# Altium project Luna_UI_V2.0.PrjPcb
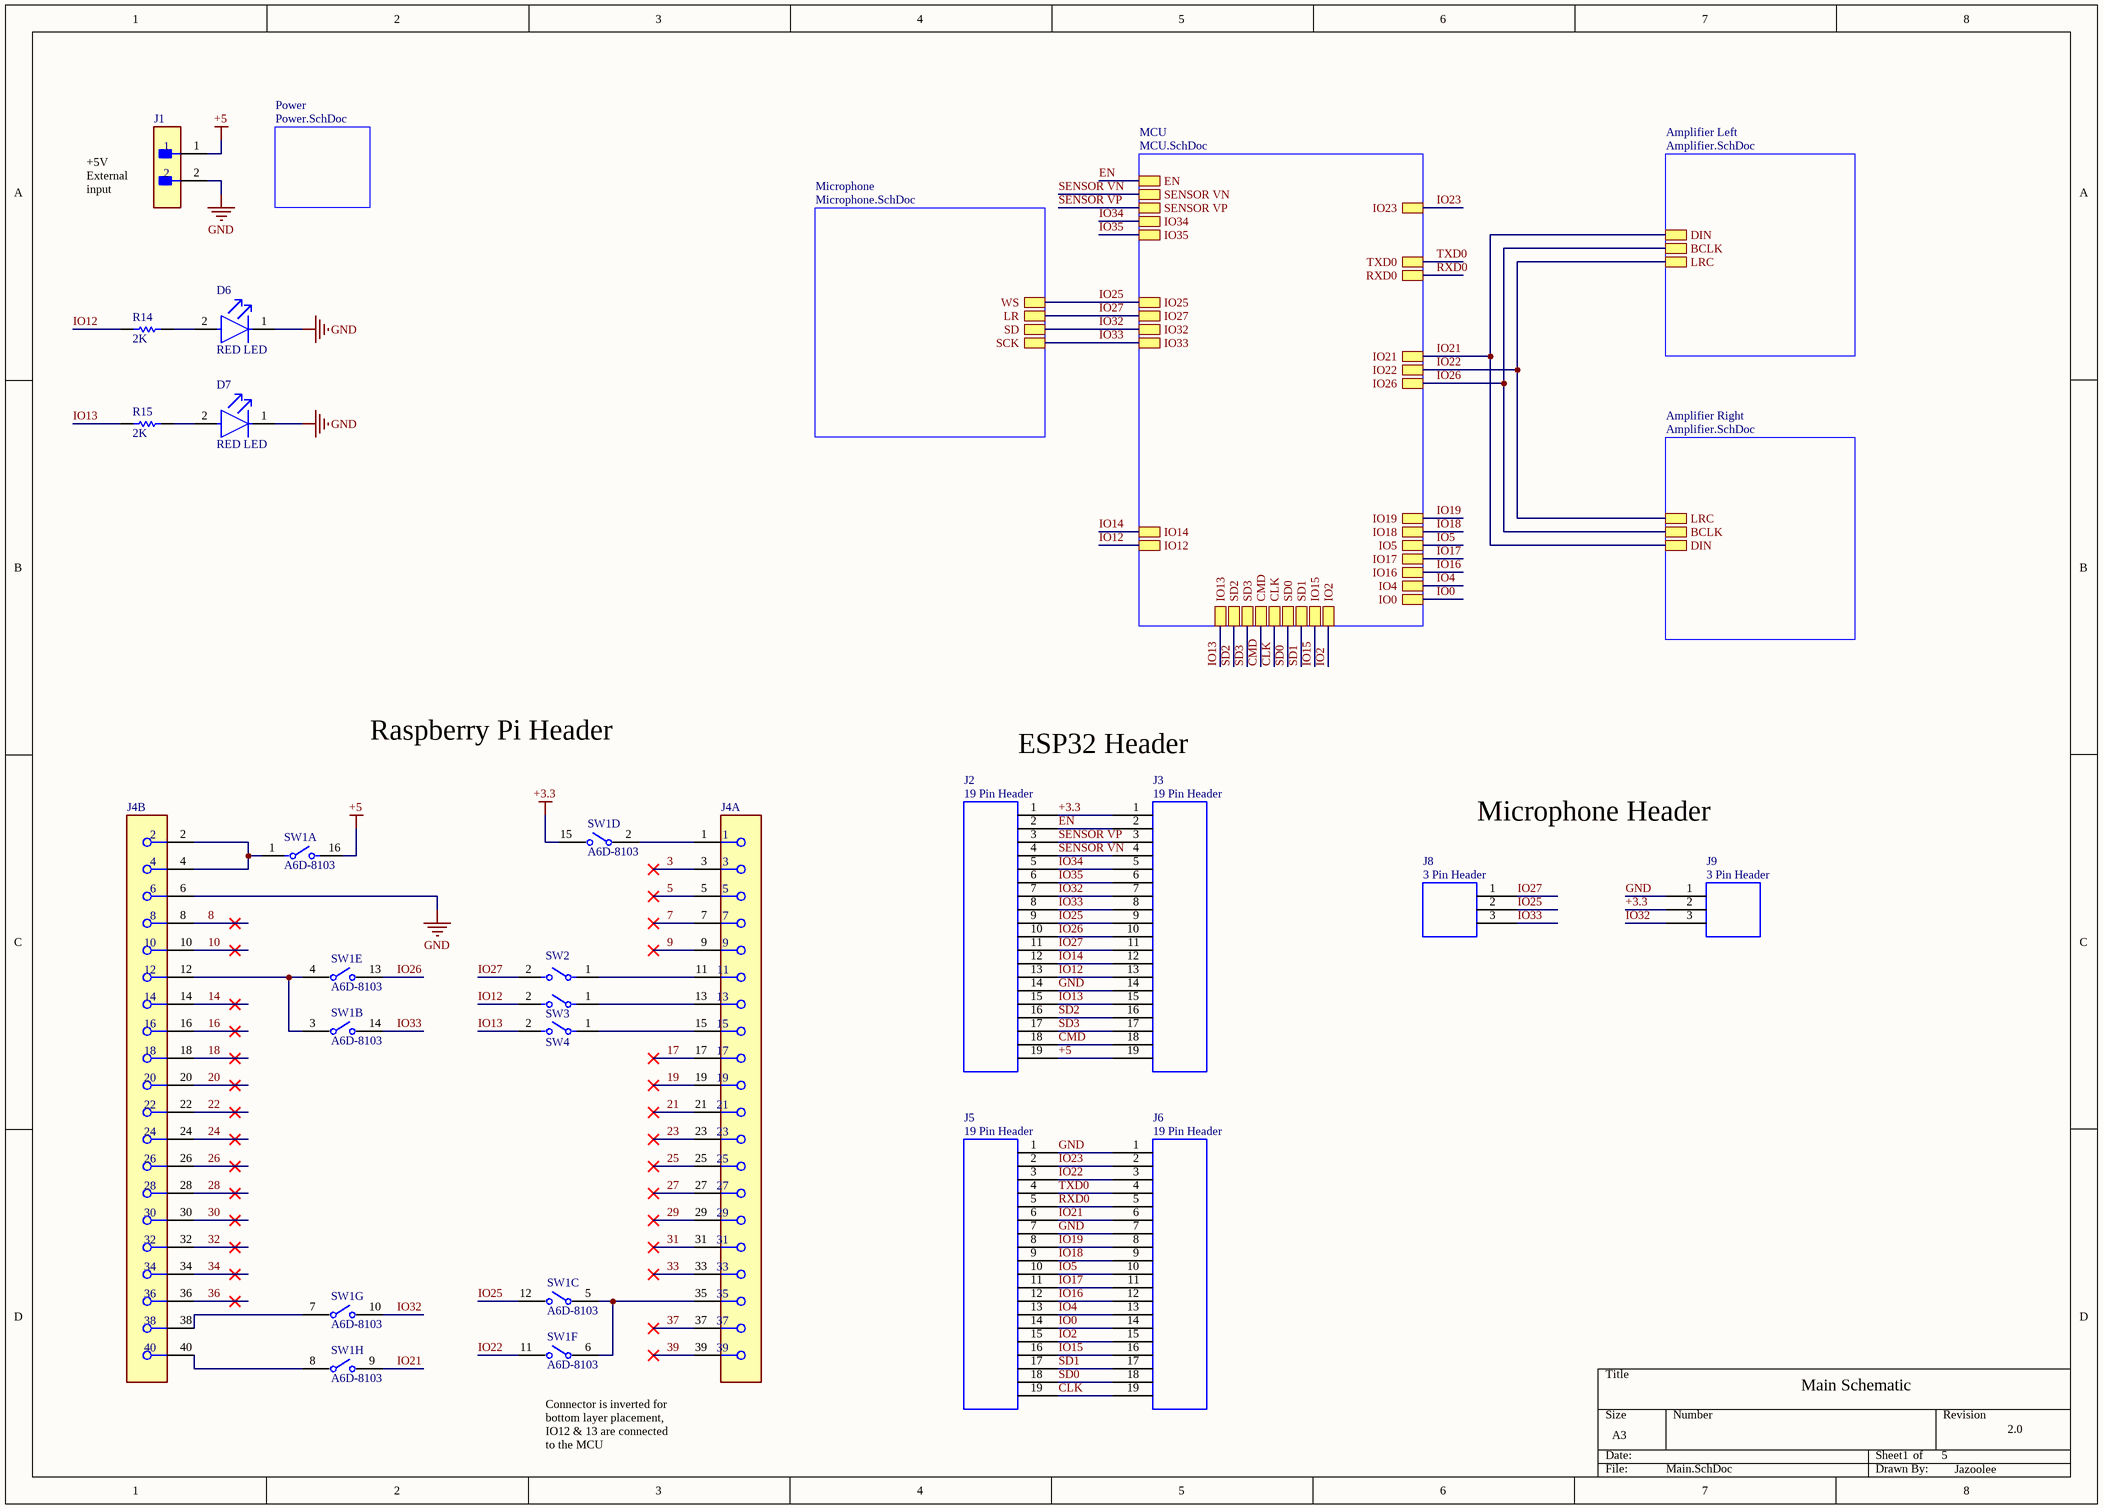
[diagram p0: Main.SchDoc]
5 sheets, 61 parts. Net scope: hierarchical (ports join the sheet entries above them; power ports are global).
Board file: Main.PcbDoc
Sheets:
  Main.SchDoc
    MCU = MCU.SchDoc
    Microphone = Microphone.SchDoc
    Amplifier Left = Amplifier.SchDoc
    Amplifier Right = Amplifier.SchDoc
    Power = Power.SchDoc

## Sheet Main.SchDoc
size A3; SheetNumber: 1; SheetTotal: 5

### Parts
D6  Color: RED LED  [FP-HSMS-C150-MFG]  (hidden comment: HSMS-C150)
D7  Color: RED LED  [FP-HSMS-C150-MFG]  (hidden comment: HSMS-C150)
J1  B2B-XH-A(LF)(SN)  [FP-B2B-XH-A_LF_SN-MFG]  (value not drawn)
J2  19 Pin Header  [19 Pin Header]
J3  19 Pin Header  [19 Pin Header]
J4  SFH11-PBPC-D20-ST-BK  [FP-SFH11-PBPC-D20-ST-BK-MFG]  (value not drawn)  (parts A,B of 2)
J5  19 Pin Header  [19 Pin Header]
J6  19 Pin Header  [19 Pin Header]
J8  3 Pin Header  [3 Pin Header]
J9  3 Pin Header  [3 Pin Header]
R14  value 2K  [RESC2013X60X35LL10T20]  (hidden comment: RT0805FRE072KL)
R15  value 2K  [RESC2013X60X35LL10T20]  (hidden comment: RT0805FRE072KL)
SW1  A6D-8103  [FP-A6D-8103-MFG]  (parts A,B,C,D,E,F,G,H of 8)
SW2  BD01  [FP-BD01-MFG]  (value not drawn)
SW3  BD01  [FP-BD01-MFG]  (value not drawn)
SW4  BD01  [FP-BD01-MFG]  (value not drawn)

### Sub-sheets
Amplifier Left = Amplifier.SchDoc: LRC, BCLK, DIN
Amplifier Right = Amplifier.SchDoc: LRC, BCLK, DIN
MCU = MCU.SchDoc: IO0, IO2, IO4, IO5, IO12, IO13, IO14, IO15, IO16, IO17, IO18, IO19, IO21, IO22, IO23, IO25, IO26, IO27, IO32, IO33, IO34, IO35, CLK, CMD, EN, RXD0, TXD0, SD0, SD1, SD2, SD3, SENSOR VN, SENSOR VP
Microphone = Microphone.SchDoc: LR, WS, SCK, SD
Power = Power.SchDoc: no entries

### Nets
+3.3: J2.1 J3.1 J9.2 SW1.15
+5: J1.1 J2.19 J3.19 SW1.16
GND: D6.1(C) D7.1(C) J1.2 J2.14 J3.14 J4.6 J5.1 J5.7 J6.1 J6.7 J9.1
3: J4.3
5: J4.5
7: J4.7
8: J4.8
9: J4.9
10: J4.10
14: J4.14
16: J4.16
17: J4.17
18: J4.18
19: J4.19
20: J4.20
21: J4.21
22: J4.22
23: J4.23
24: J4.24
25: J4.25
26: J4.26
27: J4.27
28: J4.28
29: J4.29
30: J4.30
31: J4.31
32: J4.32
33: J4.33
34: J4.34
36: J4.36
37: J4.37
39: J4.39
CLK: J5.19 J6.19 ; sheet MCU/CLK
CMD: J2.18 J3.18 ; sheet MCU/CMD
EN: J2.2 J3.2 ; sheet MCU/EN
IO0: J5.14 J6.14 ; sheet MCU/IO0
IO2: J5.15 J6.15 ; sheet MCU/IO2
IO4: J5.13 J6.13 ; sheet MCU/IO4
IO5: J5.10 J6.10 ; sheet MCU/IO5
IO12: J2.13 J3.13 R14.2 SW3.2 ; sheet MCU/IO12
IO13: J2.15 J3.15 R15.2 SW4.2 ; sheet MCU/IO13
IO14: J2.12 J3.12 ; sheet MCU/IO14
IO15: J5.16 J6.16 ; sheet MCU/IO15
IO16: J5.12 J6.12 ; sheet MCU/IO16
IO17: J5.11 J6.11 ; sheet MCU/IO17
IO18: J5.9 J6.9 ; sheet MCU/IO18
IO19: J5.8 J6.8 ; sheet MCU/IO19
IO21: J5.6 J6.6 SW1.9 ; sheet MCU/IO21, sheet Amplifier Left/DIN, sheet Amplifier Right/DIN  [project net DIN]
IO22: J5.3 J6.3 SW1.11 ; sheet MCU/IO22, sheet Amplifier Left/LRC, sheet Amplifier Right/LRC
IO23: J5.2 J6.2 ; sheet MCU/IO23
IO25: J2.9 J3.9 J8.2 SW1.12 ; sheet MCU/IO25, sheet Microphone/WS
IO26: J2.10 J3.10 SW1.13 ; sheet MCU/IO26, sheet Amplifier Left/BCLK, sheet Amplifier Right/BCLK  [project net BCLK]
IO27: J2.11 J3.11 J8.1 SW2.2 ; sheet MCU/IO27, sheet Microphone/LR
IO32: J2.7 J3.7 J9.3 SW1.10 ; sheet MCU/IO32, sheet Microphone/SD
IO33: J2.8 J3.8 J8.3 SW1.14 ; sheet MCU/IO33, sheet Microphone/SCK
IO34: J2.5 J3.5 ; sheet MCU/IO34
IO35: J2.6 J3.6 ; sheet MCU/IO35
RXD0: J5.5 J6.5 ; sheet MCU/RXD0
SD0: J5.18 J6.18 ; sheet MCU/SD0
SD1: J5.17 J6.17 ; sheet MCU/SD1
SD2: J2.16 J3.16 ; sheet MCU/SD2
SD3: J2.17 J3.17 ; sheet MCU/SD3
SENSOR VN: J2.4 J3.4 ; sheet MCU/SENSOR VN
SENSOR VP: J2.3 J3.3 ; sheet MCU/SENSOR VP
TXD0: J5.4 J6.4 ; sheet MCU/TXD0
NetD6_2: D6.2(A) R14.1
NetD7_2: D7.2(A) R15.1
NetJ4_1: J4.1 SW1.2
NetJ4_2: J4.2 J4.4 SW1.1
NetJ4_11: J4.11 SW2.1
NetJ4_12: J4.12 SW1.3 SW1.4
NetJ4_13: J4.13 SW3.1
NetJ4_15: J4.15 SW4.1
NetJ4_35: J4.35 SW1.5 SW1.6
NetJ4_38: J4.38 SW1.7
NetJ4_40: J4.40 SW1.8

### Notes on the sheet
- (near J1) +5V External input
- Raspberry Pi Header
- ESP32 Header
- Microphone Header
- Main Schematic
- Connector is inverted for bottom layer placement, IO12 & 13 are connected to the MCU
- 1
- 5
- 2.0
- Jazoolee

### Library data of the parts
D6 D7 = CMP-21615-000001-1: LED RED; Luminous Intensity: 10mcd; Power Dissipation: 65mW; Viewing Angle: 170°; Number of Elements: 1; Forward Current: 20mA; Lens Color: White; Lens Style: Rectangular; Wavelength: 626nm; Forward Voltage: 2.1V; Lens Transparency: Diffused; Reverse Voltage: 5V; Number of Pins: 2; Lead Free: Lead Free; Width: 1.6mm; Length: 3.2mm; REACH SVHC: No SVHC; Height: 1.1mm; Depth: 1.6mm; Power Rating: 65mW; Package Quantity: 1; Illumination Color: Red; Radiation Hardening: No; Case Code (Imperial): 1206; Max Operating Temperature: 85°C; Test Current: 20mA; Case/Package: 1206; Number of LEDs: 1; Packaging: Tape and Reel; Mount: Surface Mount; Min Operating Temperature: -40°C; Case Code (Metric): 3216; Dominant Wavelength: 626nm
J1 = CMP-2000-05888-3: CONN HEADER VERT 2POS 2.5MM; Current Rating: 3A; Voltage Rating: 250V; Number of Contacts: 2; Contact Resistance: 20mR; Wire/Cable Gauge: 22AWG; Insulation Resistance: 1GR; Connector Type: Male Pin; Packaging: Bulk; Contact Material: Brass; Lead Free: Lead Free; Orientation: Straight; Contact Plating: Tin; Max Current Rating: 3A; Termination: Solder; Fastening Type: Detent; Depth: 5.75mm; Housing Material: Polyamide; REACH SVHC: No SVHC; Series: XH; Voltage Rating (AC): 250V; Number of Positions: 2; Color: Natural; Contact Type: Male Pin; Max Voltage Rating (DC): 250V; Pitch: 2.5mm; Lead Pitch: 2.5mm; Mount: Through Hole; Max Operating Temperature: 85°C; Length: 7.4mm; Max Voltage Rating (AC): 250V; Min Operating Temperature: -25°C; Number of Rows: 1; Housing Color: White
J4 = CMP-25680-000025-1: CONN HDR 40POS 0.1 GOLD PCB; Pitch: 0.1inch; Number of Positions: 40; Connector Type: Header; Color: Black; Mount: Through Hole; Number of Rows: 2; Contact Plating: Gold; Lead Free: Lead Free; Packaging: Tray; Row Spacing: 0.1inch; Termination: Solder; Package Quantity: 1
R14 R15 = CMP-2001-01475-1: Manufacturer: Yageo; Part Number: RT0805FRE072KL
SW1 = CMP-08827-000003-1: SWITCH SLIDE DIP SPST 30MA 30V; Manufacturer: Omron Electronics Inc-EMC Div; Electromechanical Life: 2000Cycles; Standoff Height: 0.7mm; Throw Configuration: 8PST; Contact Resistance: 100mΩ; Number Of Circuits: 8; ComponentLink2Description: Datasheet; Temperature: -20°C to +70°C; Mouser Description: DIP Switches / SIP Switches 8 Pins Sealed Raised Actuator; Device Class L1: Electromechanical; Device Class L3: DIP Switches; ComponentLink2URL: https://omronfs.omron.com/en_US/ecb/products/pdf/en-a6d_a6dr.pdf; Contact Current Rating: 30mA; Package: 0; Device Class L2: Switches; Temperature Range Low: -20°C; Ambient Temperature Range Low: -20°C; Lead Free: Yes; Category: Switch; Automotive: No; Digikey Description: SWITCH SLIDE DIP SPST 30MA 30V; Octopart: https://octopart.com/a6d-8103-omron-134189; Temperature Range High: +70°C; Ambient Temperature Range High: +70°C; RoHS: TRUE; Manufacturer Part Number: A6D-8103; Mount: Through Hole
SW2-SW4 = CMP-10033-000004-1: SWITCH SLIDE DIP SPST 100MA 5V; Max Voltage Rating (DC): 25V; Contact Current Rating: 25mA; Pitch: 0.1inch; Number of Circuits: 1; Actuator Material: Nylon; Life (Cycles): 10000Cycles; Body Material: PBT; Approvals: UL; Actuator Type: Slide (Standard); Washable: Yes; Actuator Length: 0.9mm; Capacitance: 5pF; Length: 0.18inch; Lead Free: Lead Free; Material: Nylon; Termination: PC Pin; Orientation: Straight; Throw Configuration: SPST; Case/Package: DIP; Package Quantity: 115; Packaging: Rail/Tube; Number of Positions: 1; Max Operating Temperature: 85°C; Terminal Pitch: 2.54mm; Mount: Through Hole; Min Operating Temperature: -40°C; RoHS Compliant: Yes; Depth: 9.65mm; Electrical Life: 10000Cycles; Series: BD; Contact Material: Bronze; Max Current Rating: 100mA; Current Rating: 100mA; Mechanical Life: 10000Cycles; Number of Poles: 1; REACH SVHC: No SVHC; Contact Plating: Gold; Radiation Hardening: No; Width: 9.65mm; Voltage Rating (DC): 5V

## Sheet MCU.SchDoc
size A3; SheetNumber: 2; SheetTotal: 4
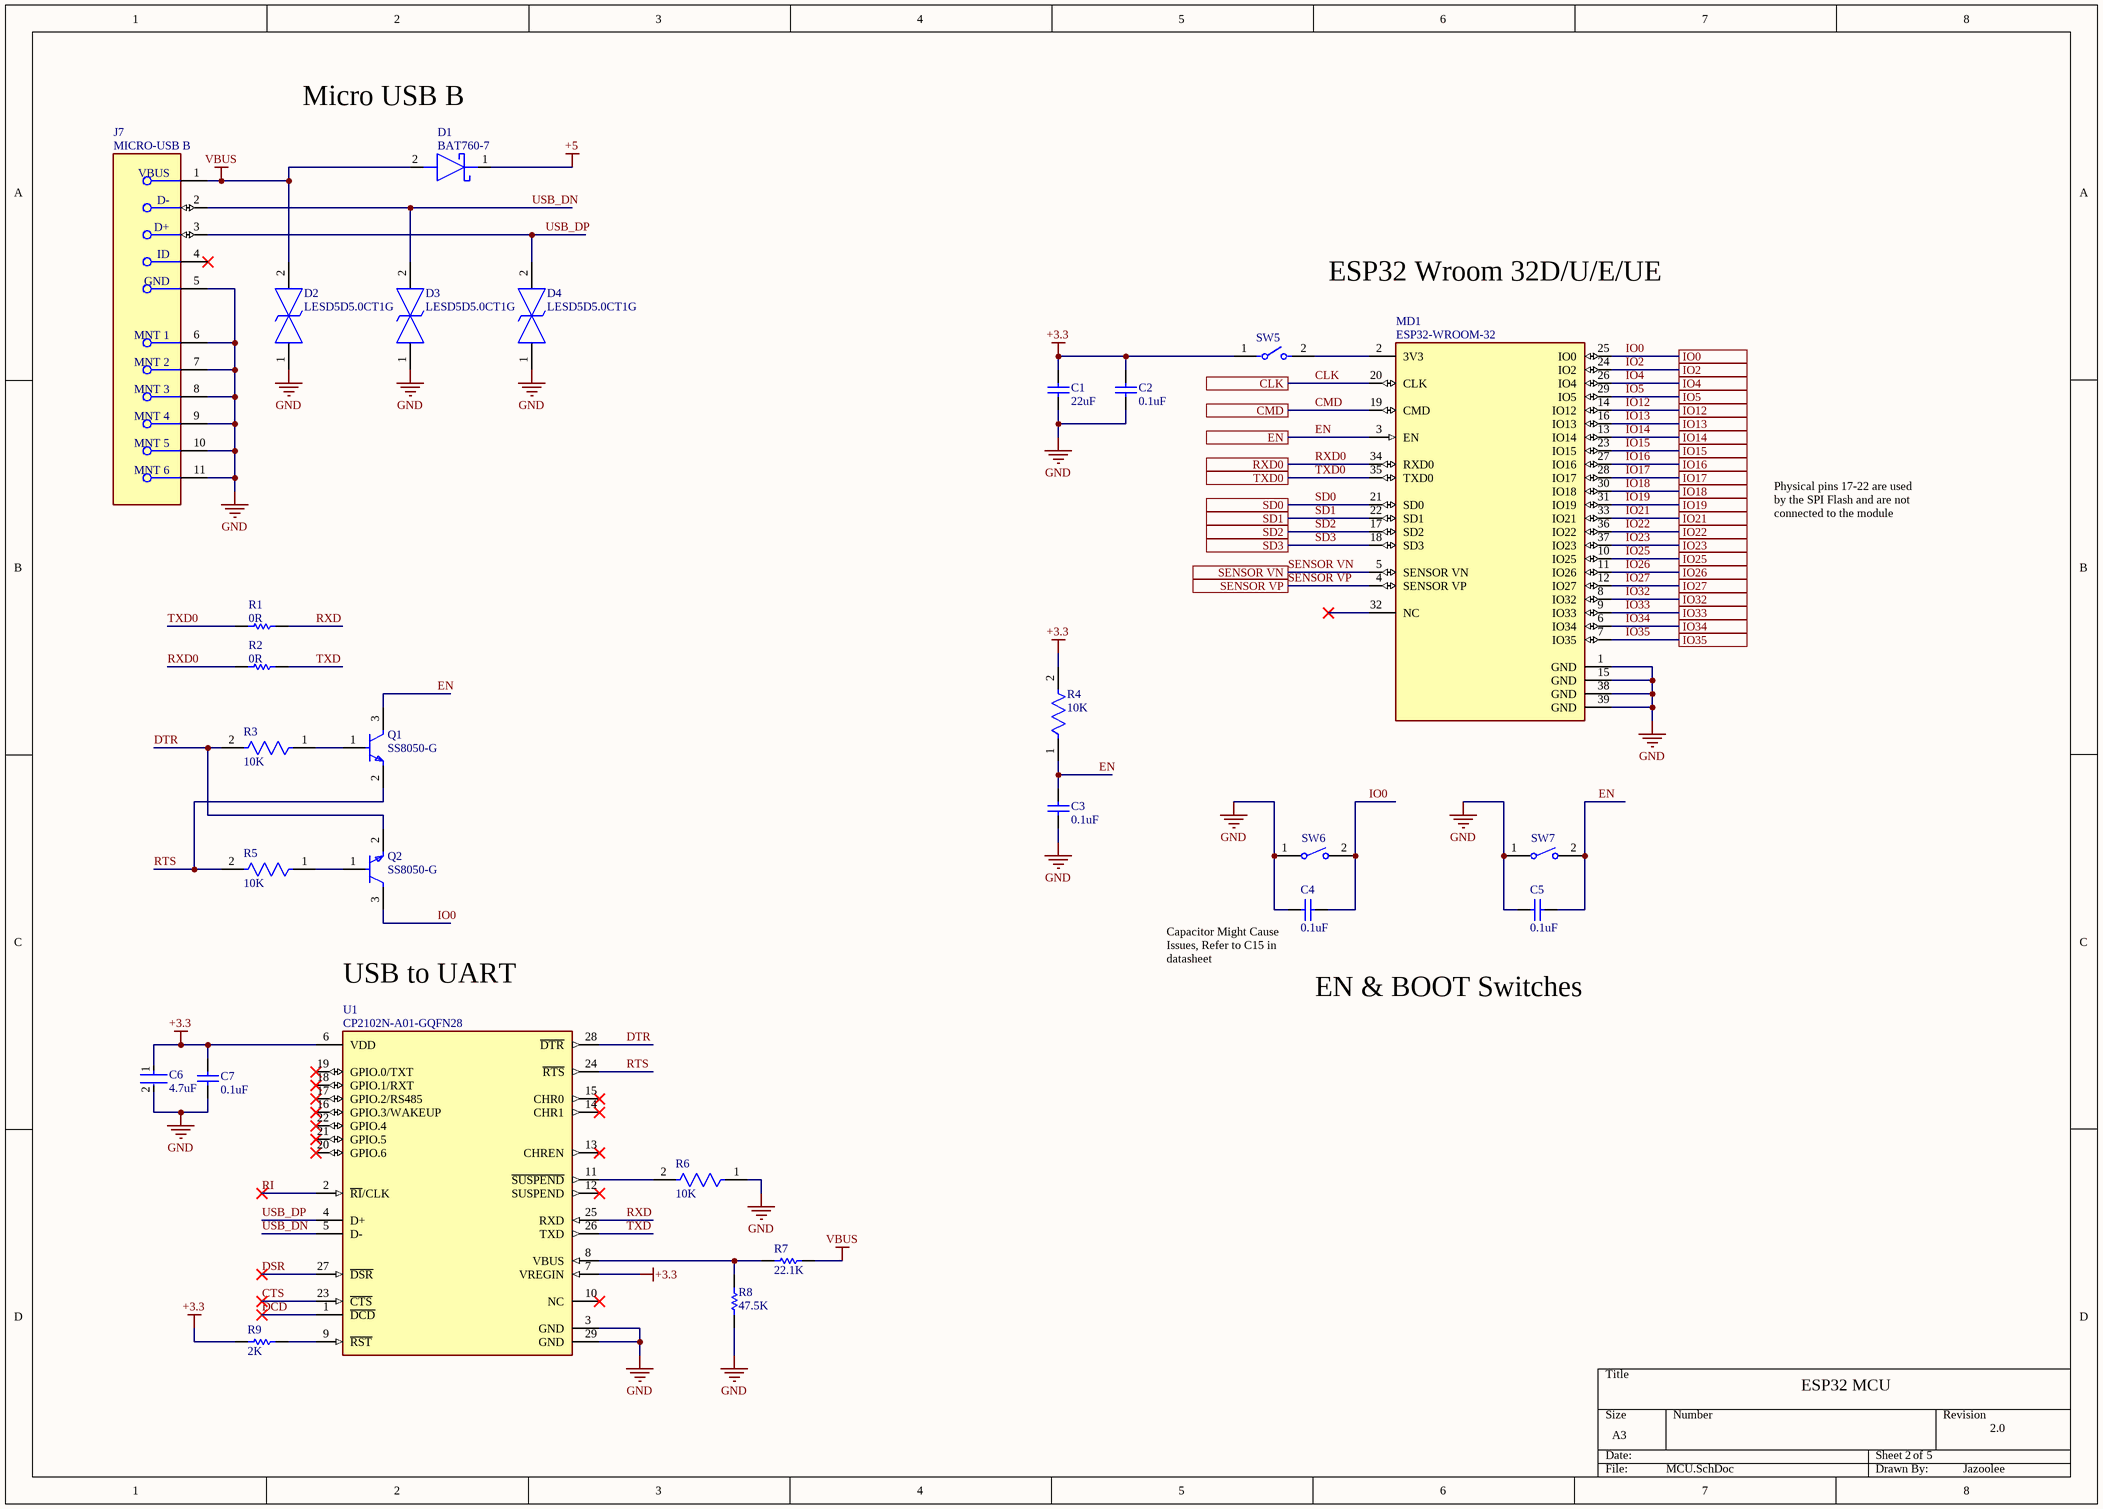
[diagram p1: MCU.SchDoc]

### Parts
C1  value 22uF  [CAPC2014X150X70ML20]  (hidden comment: TACR226M010XTA)
C2  value 0.1uF  [CAPC2013X140X50LL20T25]  (hidden comment: 08055F104KAT2A)
C3  value 0.1uF  [CAPC2013X140X50LL20T25]  (hidden comment: 08055F104KAT2A)
C4  value 0.1uF  [CAPC2013X140X50LL20T25]  (hidden comment: 08055F104KAT2A)
C5  value 0.1uF  [CAPC2013X140X50LL20T25]  (hidden comment: 08055F104KAT2A)
C6  Capacitance: 4.7uF  [FP-CL21-IPC_B]  (hidden comment: CL21A475KQFNNNF)
C7  value 0.1uF  [CAPC2013X140X50LL20T25]  (hidden comment: 08055F104KAT2A)
D1  BAT760-7  [SOD2512X110N]
D2  LESD5D5.0CT1G  [LESD5D50CT1G]
D3  LESD5D5.0CT1G  [LESD5D50CT1G]
D4  LESD5D5.0CT1G  [LESD5D50CT1G]
J7  MICRO-USB B  [FP-473460001-MFG]
MD1  ESP32-WROOM-32  [FP-ESP32-WROOM-32-MFG]
Q1  SS8050-G  [FP-SS8050-G-MFG]
Q2  SS8050-G  [FP-SS8050-G-MFG]
R1  value 0R  [RESC2013X60X35LL10T20]  (hidden comment: RC0805JR-100RL)
R2  value 0R  [RESC2013X60X35LL10T20]  (hidden comment: RC0805JR-100RL)
R3  Resistance: 10K  [FP-RMCF0805-IPC_A]  (hidden comment: RMCF0805JT10K0)
R4  Resistance: 10K  [FP-RMCF0805-IPC_A]  (hidden comment: RMCF0805JT10K0)
R5  Resistance: 10K  [FP-RMCF0805-IPC_A]  (hidden comment: RMCF0805JT10K0)
R6  Resistance: 10K  [FP-RMCF0805-IPC_A]  (hidden comment: RMCF0805JT10K0)
R7  value 22.1K  [RESC2013X50X30LL20T20]  (hidden comment: CRCW080522K1FKTA)
R8  value 47.5K  [RESC2013X70X40NL20T20]  (hidden comment: ERJ-6ENF4752V)
R9  value 2K  [RESC2013X60X35LL10T20]  (hidden comment: RT0805FRE072KL)
SW5  BD01  [FP-BD01-MFG]  (value not drawn)
SW6  FSMSM  [TECO-FSMSM-2_V]  (value not drawn)
SW7  FSMSM  [TECO-FSMSM-2_V]  (value not drawn)
U1  CP2102N-A01-GQFN28  [FP-CP2102N-A01-GQFN28-MFG]

### Ports
CLK (see Main[5B]), CMD (see Main[5B]), EN (see Main[5A]), IO0 (see Main[6B]), IO2 (see Main[6B]), IO4 (see Main[6B]), IO5 (see Main[6B]), IO12 (see Main[5B]), IO13 (see Main[5B]), IO14 (see Main[5B]), IO15 (see Main[6B]), IO16 (see Main[6B]), IO17 (see Main[6B]), IO18 (see Main[6B]), IO19 (see Main[6B]), IO21 (see Main[6A]), IO22 (see Main[6A]), IO23 (see Main[6A]), IO25 (see Main[5A]), IO26 (see Main[6B]), IO27 (see Main[5A]), IO32 (see Main[5A]), IO33 (see Main[5A]), IO34 (see Main[5A]), IO35 (see Main[5A]), RXD0 (see Main[6A]), SD0 (see Main[5B]), SD1 (see Main[5B]), SD2 (see Main[5B]), SD3 (see Main[5B]), SENSOR VN (see Main[5A]), SENSOR VP (see Main[5A]), TXD0 (see Main[6A])

### Nets
+3.3: C1.2 C2.2 C6.1 C7.2 R4.2 R9.2 SW5.1 U1.6(VDD) U1.7(VREGIN)
+5: D1.1(K)
GND: C1.1 C2.1 C3.1 C4.2 C5.2 C6.2 C7.1 D2.1 D3.1 D4.1 J7.5(GND) J7.6(MNT_1) J7.7(MNT_2) J7.8(MNT_3) J7.9(MNT_4) J7.10(MNT_5) J7.11(MNT_6) MD1.1(GND) MD1.15(GND) MD1.38(GND) MD1.39(GND) R6.1 R8.1 SW6.1 SW7.1 U1.3(GND) U1.29(GND)
VBUS: D1.2(A) D2.2 J7.1(VBUS) R7.1
CLK: MD1.20(CLK) ; port CLK
CMD: MD1.19(CMD) ; port CMD
CTS: U1.23(~{CTS})
DCD: U1.1(~{DCD})
DSR: U1.27(~{DSR})
DTR: Q2.2(E) R3.2 U1.28(~{DTR})
EN: C3.2 C5.1 MD1.3(EN) Q1.3(C) R4.1 SW7.2 ; port EN
IO0: C4.1 MD1.25(IO0) Q2.3(C) SW6.2 ; port IO0
IO2: MD1.24(IO2) ; port IO2
IO4: MD1.26(IO4) ; port IO4
IO5: MD1.29(IO5) ; port IO5
IO12: MD1.14(IO12) ; port IO12
IO13: MD1.16(IO13) ; port IO13
IO14: MD1.13(IO14) ; port IO14
IO15: MD1.23(IO15) ; port IO15
IO16: MD1.27(IO16) ; port IO16
IO17: MD1.28(IO17) ; port IO17
IO18: MD1.30(IO18) ; port IO18
IO19: MD1.31(IO19) ; port IO19
IO21: MD1.33(IO21) ; port IO21  [project net DIN]
IO22: MD1.36(IO22) ; port IO22
IO23: MD1.37(IO23) ; port IO23
IO25: MD1.10(IO25) ; port IO25
IO26: MD1.11(IO26) ; port IO26  [project net BCLK]
IO27: MD1.12(IO27) ; port IO27
IO32: MD1.8(IO32) ; port IO32
IO33: MD1.9(IO33) ; port IO33
IO34: MD1.6(IO34) ; port IO34
IO35: MD1.7(IO35) ; port IO35
RI: U1.2(~{RI}/CLK)
RTS: Q1.2(E) R5.2 U1.24(~{RTS})
RXD: R1.2 U1.25(RXD)
RXD0: MD1.34(RXD0) R2.1 ; port RXD0
SD0: MD1.21(SD0) ; port SD0
SD1: MD1.22(SD1) ; port SD1
SD2: MD1.17(SD2) ; port SD2
SD3: MD1.18(SD3) ; port SD3
SENSOR VN: MD1.5(SENSOR_VN) ; port SENSOR VN
SENSOR VP: MD1.4(SENSOR_VP) ; port SENSOR VP
TXD: R2.2 U1.26(TXD)
TXD0: MD1.35(TXD0) R1.1 ; port TXD0
USB_DN: D3.2 J7.2(D-) U1.5(D-)
USB_DP: D4.2 J7.3(D+) U1.4(D+)
NetMD1_2: MD1.2(3V3) SW5.2
NetQ1_1: Q1.1(B) R3.1
NetQ2_1: Q2.1(B) R5.1
NetR6_2: R6.2 U1.11(~{SUSPEND})
NetR7_2: R7.2 R8.2 U1.8(VBUS)
NetR9_1: R9.1 U1.9(~{RST})

Not connected (* = marked no-connect by the designer): J7 4(ID)*; MD1 32(NC)*; U1 10(NC)* 12(SUSPEND)* 13(CHREN)* 14(CHR1)* 15(CHR0)* 16(GPIO.3/WAKEUP)* 17(GPIO.2/RS485)* 18(GPIO.1/RXT)* 19(GPIO.0/TXT)* 20(GPIO.6)* 21(GPIO.5)* 22(GPIO.4)*

### Notes on the sheet
- Micro USB B
- ESP32 Wroom 32D/U/E/UE
- Physical pins 17-22 are used by the SPI Flash and are not connected to the module
- USB to UART
- (near C4) Capacitor Might Cause Issues, Refer to C15 in datasheet
- EN & BOOT Switches
- ESP32 MCU
- 2
- 5
- 2.0
- Jazoolee

### Library data of the parts
C1 = CMP-2007-00033-1: 22uF 10V 20% Tantalum 0805; Manufacturer: AVX Interconnect / Elco; Part Number: TACR226M010XTA
C2-C5 C7 = CMP-2007-04784-1: 100nF 0805 Ceramic 50V 10%; Manufacturer: AVX Interconnect / Elco; Part Number: 08055F104KAT2A
C6 = CMP-13271-001343-1: CL21 Series 0805 4.7uF 6.3V ±10% Tolerance X5R Multilayer Ceramic Chip Capacitor; Case/Package: 0805; Length: 2mm; Width: 0.049inch; Thickness: 0.053inch; Package Quantity: 10000; Voltage Rating: 6.3V; Depth: 1.25mm; Radiation Hardening: No; Tolerance: 10%; Dielectric: X5R; Height: 1.25mm; Packaging: Tape and Reel; Min Operating Temperature: -55°C; Max Operating Temperature: 85°C; Mount: Surface Mount
D1 = BAT760,115: Schottky Diode; Manufacturer_Name: Nexperia; Datasheet Link: https://assets.nexperia.com/documents/data-sheet/BAT760.pdf; Height: 1.1mm; Manufacturer_Part_Number: BAT760,115; Mouser Part Number: 771-BAT760-T/R; Mouser Price/Stock: https://www.mouser.co.uk/ProductDetail/Nexperia/BAT760115?qs=me8TqzrmIYUT08NCquDVCQ%3D%3D; Arrow Part Number: BAT760,115; Arrow Price/Stock: https://www.arrow.com/en/products/bat760115/nexperia?region=europe
D2-D4 = LESD5D5.0CT1G: TVS Diode (Bi-directional); Manufacturer_Name: LRC; Height: 0.7mm; Manufacturer_Part_Number: LESD5D5.0CT1G
J7 = CMP-2000-05246-2: CONN RCPT USB2.0 MICRO B SMD R/A; Manufacturer: Molex; Manufacturer Part Number: 473460001; Conn Orientation: Right Angle; Is Female: yes; Shielding: true; Pitch: 0.65mm; Number Of Contacts: 5; Description: USB - micro B USB 2.0 Receptacle Connector 5 Position Surface Mount, Right Angle; Voltage Rating: 30V; Current Rating: 1.8A; Device Class L2: USB Connectors; Digikey Description: CONN RCPT USB2.0 MICRO B SMD R/A; Height: 2.945mm; RoHS: TRUE; ComponentLink2Description: Datasheet; Octopart: https://octopart.com/47346-0001-molex-7164928; Automotive: No; Package: 0; Category: Conn; Device Class L1: Connectors; Usb Standard: USB 2.0; Temperature: -30°C to +85°C; Temperature Range Low: -30°C; Footprint Url: https://www.molex.com/pdm_docs/sd/473460001_sd.pdf; ComponentLink2URL: https://www.molex.com/webdocs/datasheets/pdf/en-us/0473460001_IO_CONNECTORS.pdf; Lead Free: Yes; Contact Material: Gold,Nickel; Temperature Range High: +85°C; Device Class L3: unset
MD1 = CMP-194065-000008-1: RX TXRX MOD WIFI SURFACE MOUNT; Frequency: 2.5GHz; Sensitivity: -98dBm; Operating Supply Voltage: 3.6V; Data Rate: 150Mbps; Weight: 0.088185oz; Package Quantity: 550; Min Operating Temperature: -40°C; Mount: Surface Mount; Max Operating Temperature: 85°C; Packaging: Cut Tape; Case/Package: SMD/SMT
Q1 Q2 = CMP-20235-000001-1: NPN TRANSISTOR 1.5A 40V SOT-23 R; Transition Frequency: 100MHz; Max Breakdown Voltage: 25V; Collector Emitter Voltage (VCEO): 400mV; Max Power Dissipation: 300mW; Max Collector Current: 1.5A; Case/Package: TO-236-3; Packaging: Tape and Reel; RoHS Compliant: Yes; Mount: Surface Mount; Collector Emitter Breakdown Voltage: 25V
R1 R2 = CMP-2000-06963-1: Chip Resistor, 0 Ohm, +/- 5%, 125 mW, -55 to 155 degC, 0805 (2012 Metric), RoHS, Tape and Reel; Manufacturer: Yageo; Product Length (mm): 2mm; Tolerance (+ or -): NotRequired; Case Style: Molded; Product Height (mm): 0.5mm; Power Rating(s): NotRequiredW; Product Depth (mm): 1.25mm; Mounting Technology: SurfaceMount; Military Standard: NotRequired; Operating Temp Range: -55Cto155C; Temperature Coefficient: NotRequired; Package Description: 2-Pin Surface Mounted Device, Body 2 x 1.25 mm; Datasheet Version: Rev. 7, 05/2017; Failure Rate: NotRequired; Manufacturer URL: http://www.yageo.com/; Datasheet URL: http://www.yageo.com/documents/recent/PYu-RC_Group_51_RoHS_L_7.pdf; Packaging: TapeandReel; Package Reference: 0805; Package / Case: 0805; Termination Style: NotRequired; Type: ThickFilm; Construction: Rectangular
R3-R6 = CMP-26527-002663-1: 10kΩ ±5% 0.125W 0805 Thick Film Chip Resistor AEC-Q200 compliant; Max Power Dissipation: 125mW; Temperature Coefficient: 100ppm/°C; Construction: Rectangular; RoHS Compliant: Yes; Resistor Type: Thick Film; Series: RMCF; Features: Automotive AEC-Q200; Case Code (Imperial): 0805; Mount: Surface Mount; Min Operating Temperature: -55°C; Military Standard: Not; Tolerance: 5%; Size Code: 0805; Contact Plating: Tin; Length: 2mm; Depth: 1.25mm; Case Code (Metric): 2012; Packaging: Tape and Reel; Radiation Hardening: No; Height: 0.026inch; Case/Package: 0805; Width: 0.049inch; Lead Free: Lead Free; Max Operating Temperature: 155°C; Number of Terminations: 2; Power Rating: 125mW
R7 = CMP-1013-00660-2: 22.1K 0805 5%; Manufacturer: Vishay Dale; Part Number: CRCW080522K1FKTA
R8 = CMP-1013-00700-2: 47.5K 0805 5%; Manufacturer: Panasonic; Part Number: ERJ-6ENF4752V
R9 = CMP-2001-01475-1: Manufacturer: Yageo; Part Number: RT0805FRE072KL
SW5 = CMP-10033-000004-1: as SW2 on sheet Main; Length: 0.18inch; Lead Free: Lead Free; Material: Nylon; Termination: PC Pin; Orientation: Straight; Throw Configuration: SPST; Case/Package: DIP; Package Quantity: 115; Packaging: Rail/Tube; Number of Positions: 1; Max Operating Temperature: 85°C; Terminal Pitch: 2.54mm; Mount: Through Hole; Min Operating Temperature: -40°C; RoHS Compliant: Yes; Depth: 9.65mm; Electrical Life: 10000Cycles; Series: BD; Contact Material: Bronze; Max Current Rating: 100mA; Current Rating: 100mA; Mechanical Life: 10000Cycles; Number of Poles: 1; REACH SVHC: No SVHC; Contact Plating: Gold; Radiation Hardening: No; Width: 9.65mm; Voltage Rating (DC): 5V
SW6 SW7 = CMP-2000-07511-1: FSMSM Push Button Switch, 50 mA, -35 to 85 degC, 2-Pin SMD, RoHS, Bulk; Manufacturer: TE Connectivity; Actuator Length: 1.07mm; Electrical Life: 20000Cycles; Actuator Material: Polyamide; Current Rating: 50mA; Illumination Type: Illuminated; Voltage Rating (DC): 24V; Contact Resistance: 100mOhm; Case\/Package: SMD/SMT; Operating Force: 180gf; Switch Travel: 0.25mm; Max Voltage Rating (DC): 12V; Throw Configuration: SPST; Packaging: LoosePiece; Max Operating Temperature: 85degC; ELV: Compliant; Package Description: 2-Pin Surface Mount Device, Body 6 x 3.5 mm, Pitch 9.19 mm; RoHSCompliant: true; Manufacturer URL: http://www.te.com/; Contact Plating: Silver; Contact Material: Brass; Mounting Technology: SurfaceMount; Contact Current Rating: 50mA; Datasheet Version: Rev. C2, 08/2014; Datasheet URL: http://www.te.com/commerce/DocumentDelivery/DDEController?Action=showdoc&DocId=Customer+Drawing%7F1437566-3%7FC2%7Fpdf%7FEnglish%7FENG_CD_1437566-3_C2_1437566_3_1_c.dwg.pdf%7F1437566-3; Mechanical Life: 20000Cycles; Package Reference: FSMSM; REACH SVHC: Unknown; Orientation: Straight; Min Operating Temperature: -35degC; Lead Free: LeadFree; Termination: GullWing; Package Quantity: 1000; Mount: SurfaceMount
U1 = CMP-08093-000004-1: IC BRIDGE USB TO UART 28QFN; Manufacturer: Silicon Labs; Standoff Height: 0mm; Max Junction Temp: +105°C; Usb Standard: USB 2.0; Number Of Ports: 1; Nominal Supply Current: 195-13700uA; Min Supply Voltage: 1.71V; Max Supply Voltage: 5.25V; Interface: UART,USB,RS-232,RS-485; Height: 0.8mm; Package: CP2102N-A01-GQFN28; Temperature Range Low: -40°C; Lead Free: Yes; Category: IC; Ambient Temperature Range High: +85°C; Device Class L3: USB Interface ICs; Octopart: https://octopart.com/cp2102n-a01-gqfn28-silicon+labs-74636024; Manufacturer Part Number: CP2102N-A01-GQFN28; Device Class L2: Interface ICs; ComponentLink2URL: https://media.digikey.com/pdf/Data%20Sheets/Silicon%20Laboratories%20PDFs/CP2102N_Rev.1.3_DS.pdf; Automotive: No; Temperature: -40°C to +85°C; Device Class L1: Integrated Circuits (ICs); Mouser Description: IC BRIDGE USB TO UART 28QFN; RoHS: TRUE; Ambient Temperature Range Low: -40°C; Temperature Range High: +85°C; Ipc Land Pattern Name: QFN50P500X500X75-28; Digikey Description: IC BRIDGE USB TO UART 28QFN; ComponentLink2Description: Datasheet

## Sheet Microphone.SchDoc
size A4; SheetNumber: 5; SheetTotal: 5
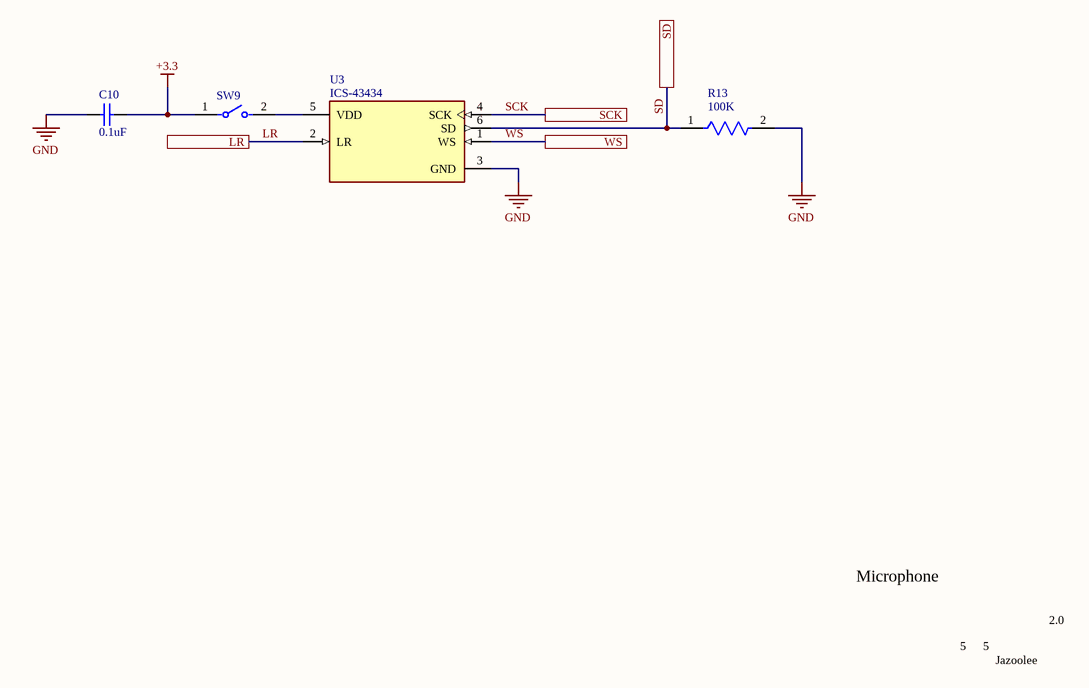
[diagram p2: Microphone.SchDoc]

### Parts
C10  value 0.1uF  [CAPC2013X140X50LL20T25]  (hidden comment: 08055F104KAT2A)
R13  Resistance: 100K  [FP-ERA6A-IPC_B]  (hidden comment: ERA-6AEB104V)
SW9  BD01  [FP-BD01-MFG]  (value not drawn)
U3  ICS-43434  [FP-ICS-43434-MFG]

### Ports
LR (see Main[4A]), SCK (see Main[4A]), SD (see Main[4A]), WS (see Main[4A])

### Nets
+3.3: C10.1 SW9.1
GND: C10.2 R13.2 U3.3(GND)
LR: U3.2(LR) ; port LR  [project net IO27]
SCK: U3.4(SCK) ; port SCK  [project net IO33]
SD: R13.1 U3.6(SD) ; port SD  [project net IO32]
WS: U3.1(WS) ; port WS  [project net IO25]
NetSW9_2: SW9.2 U3.5(VDD)

### Notes on the sheet
- Microphone
- 5
- 2.0
- Jazoolee

### Library data of the parts
C10 = CMP-2007-04784-1: as C2 on sheet MCU; Part Number: 08055F104KAT2A
R13 = CMP-2001-00583-2: RES 100K OHM 0.1% 1/8W 0805; Max Power Dissipation: 125mW; Voltage Rating: 100V; Temperature Coefficient: 25ppm/°C; Resistance Tolerance: 0.1%; Resistor Type: Thin Film; Mount: Surface Mount; Package Quantity: 1; RoHS Compliant: Yes; Features: Automotive AEC-Q200; Termination: Solder; Contact Plating: Tin; Number of Pins: 2; Construction: Rectangular; Size Code: 0805; Case/Package: 0805; Military Standard: Not; Voltage Rating (DC): 100V; Max Operating Temperature: 155°C; REACH SVHC: No SVHC; Series: ERA-6A; Case Code (Metric): 2012; Number of Terminations: 2; Tolerance: 0.1%; Width: 1.25mm; Depth: 1.25mm; Lead Free: Lead Free; Radiation Hardening: No; Length: 2mm; Technology: METAL FILM; Power Rating: 125mW; Min Operating Temperature: -55°C; Height: 0.5mm; Case Code (Imperial): 0805; Packaging: Tape and Reel
SW9 = CMP-10033-000004-1: as SW2 on sheet Main; Length: 0.18inch; Lead Free: Lead Free; Material: Nylon; Termination: PC Pin; Orientation: Straight; Throw Configuration: SPST; Case/Package: DIP; Package Quantity: 115; Packaging: Rail/Tube; Number of Positions: 1; Max Operating Temperature: 85°C; Terminal Pitch: 2.54mm; Mount: Through Hole; Min Operating Temperature: -40°C; RoHS Compliant: Yes; Depth: 9.65mm; Electrical Life: 10000Cycles; Series: BD; Contact Material: Bronze; Max Current Rating: 100mA; Current Rating: 100mA; Mechanical Life: 10000Cycles; Number of Poles: 1; REACH SVHC: No SVHC; Contact Plating: Gold; Radiation Hardening: No; Width: 9.65mm; Voltage Rating (DC): 5V
U3 = CMP-03292-71346757-1: ICS-43434 Mic Omni-Directional -26dB 3.63V Rectangular Solder Pad T/R; Min Supply Voltage: 1.65V; Direction: Omnidirectional; Operating Supply Current: 550µA; Output Type: Digital; Max Operating Temperature: 85°C; Max Length: 3.6mm; NexarPartId: 71346757; RoHS: Compliant; Width: 2.65mm; Min Operating Temperature: -40°C; Max Supply Voltage: 3.63V; Min Length: 3.4mm; Length: 3.5mm; Min Thickness: 880µm; Lifecycle Status: Production; Min Width: 2.55mm; Max Thickness: 1.08mm; Max Width: 2.75mm; Schedule B: 8518100000; Height: 980µm

## Sheet Amplifier.SchDoc
size A4; SheetNumber: 4; SheetTotal: 4
Used 2 times, as channels Amplifier Left, Amplifier Right. Parts and nets are listed once, with the designators drawn on the sheet.
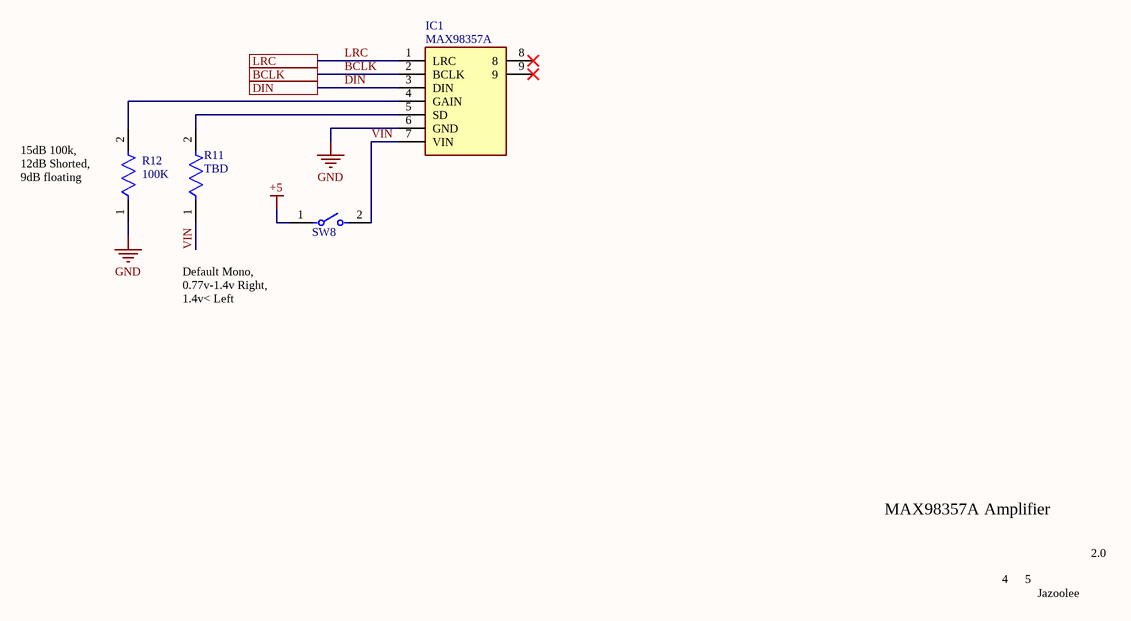
[diagram p3: Amplifier.SchDoc]

### Parts
IC1  MAX98357A  [3006]
R11  TBD  [FP-MRS25-MFG]
R12  Resistance: 100K  [FP-ERA6A-IPC_B]  (hidden comment: ERA-6AEB104V)
SW8  BD01  [FP-BD01-MFG]  (value not drawn)

### Ports
BCLK (see Main[7A]), DIN (see Main[7A]), LRC (see Main[7A])

### Nets
+5: SW8.1
GND: IC1.6(GND) R12.1
BCLK: IC1.2(BCLK) ; port BCLK
DIN: IC1.3(DIN) ; port DIN
LRC: IC1.1(LRC) ; port LRC
VIN: IC1.7(VIN) R11.1 SW8.2
NetIC1_4: IC1.4(GAIN) R12.2
NetIC1_5: IC1.5(SD) R11.2

Not connected (* = marked no-connect by the designer): IC1 8* 9*

### Channels
Amplifier Left: designators end in _Amplifier_Left; ports BCLK=BCLK DIN=DIN LRC=IO22
Amplifier Right: designators end in _Amplifier_Right; ports BCLK=BCLK DIN=DIN LRC=IO22

### Notes on the sheet
- (near R12) 15dB 100k, 12dB Shorted, 9dB floating
- Default Mono, 0.77v-1.4v Right, 1.4v< Left
- MAX98357A Amplifier
- 4
- 5
- 2.0
- Jazoolee

### Library data of the parts
IC1 = 3006: Integrated Circuit; Manufacturer_Name: Adafruit; Datasheet Link: https://cdn-learn.adafruit.com/downloads/pdf/adafruit-max98357-i2s-class-d-mono-amp.pdf; Height: 3mm; Manufacturer_Part_Number: 3006; Mouser Part Number: 485-3006; Mouser Price/Stock: https://www.mouser.co.uk/ProductDetail/Adafruit/3006?qs=SV%252B0z0o3NTtodS8r%2Ftqo5A%3D%3D; Arrow Part Number: 3006; Arrow Price/Stock: https://www.arrow.com/en/products/3006/adafruit-industries
R11 = CMP-00030-42757237-1: MRS25000C1000FRP00 Resistor, 100 Ohm, ± 1%, 600 mW, Axial Leaded, Metal Film (Thin Film), Professional; Max Power Dissipation: 600mW; Resistance: 100Ω; Voltage Rating: 350V; Temperature Coefficient: 50ppm/°C; Lead Diameter: 600µm; RoHS: Compliant; Radiation Hardening: No; Schedule B: 8533210090, 8533210090; Length: 6.5mm; Packaging: Tape & Reel (TR); Number of Terminations: 2; Mount: Through Hole; Width: 2.5mm; Tolerance: 1%; Military Standard: Not; Voltage Rating (DC): 350V; Contact Plating: Tin; Number of Pins: 2; Max Operating Temperature: 155°C; NexarPartId: 42757237; Diameter: 2.5mm; Composition: Metal Film, Thin Film; REACH SVHC: Unknown; Power Rating: 600mW; Lead Free: Lead Free; Termination: Axial; Case/Package: Axial; Min Operating Temperature: -55°C
R12 = CMP-2001-00583-2: as R13 on sheet Microphone; Resistance Tolerance: 0.1%; Resistor Type: Thin Film; Mount: Surface Mount; Package Quantity: 1; RoHS Compliant: Yes; Features: Automotive AEC-Q200; Termination: Solder; Contact Plating: Tin; Number of Pins: 2; Construction: Rectangular; Size Code: 0805; Case/Package: 0805; Military Standard: Not; Voltage Rating (DC): 100V; Max Operating Temperature: 155°C; REACH SVHC: No SVHC; Series: ERA-6A; Case Code (Metric): 2012; Number of Terminations: 2; Tolerance: 0.1%; Width: 1.25mm; Depth: 1.25mm; Lead Free: Lead Free; Radiation Hardening: No; Length: 2mm; Technology: METAL FILM; Power Rating: 125mW; Min Operating Temperature: -55°C; Height: 0.5mm; Case Code (Imperial): 0805; Packaging: Tape and Reel
SW8 = CMP-10033-000004-1: as SW2 on sheet Main; Length: 0.18inch; Lead Free: Lead Free; Material: Nylon; Termination: PC Pin; Orientation: Straight; Throw Configuration: SPST; Case/Package: DIP; Package Quantity: 115; Packaging: Rail/Tube; Number of Positions: 1; Max Operating Temperature: 85°C; Terminal Pitch: 2.54mm; Mount: Through Hole; Min Operating Temperature: -40°C; RoHS Compliant: Yes; Depth: 9.65mm; Electrical Life: 10000Cycles; Series: BD; Contact Material: Bronze; Max Current Rating: 100mA; Current Rating: 100mA; Mechanical Life: 10000Cycles; Number of Poles: 1; REACH SVHC: No SVHC; Contact Plating: Gold; Radiation Hardening: No; Width: 9.65mm; Voltage Rating (DC): 5V

## Sheet Power.SchDoc
size A4; SheetNumber: 3; SheetTotal: 5
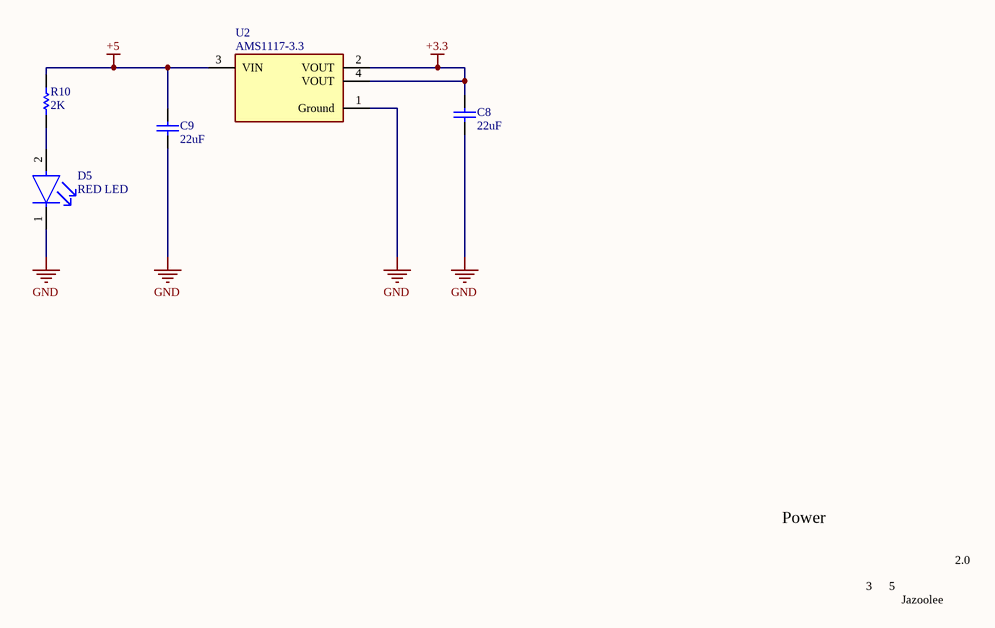
[diagram p4: Power.SchDoc]

### Parts
C8  value 22uF  [CAPC2014X150X70ML20]  (hidden comment: TACR226M010XTA)
C9  value 22uF  [CAPC2014X150X70ML20]  (hidden comment: TACR226M010XTA)
D5  Color: RED LED  [FP-HSMS-C150-MFG]  (hidden comment: HSMS-C150)
R10  value 2K  [RESC2013X60X35LL10T20]  (hidden comment: RT0805FRE072KL)
U2  AMS1117-3.3  [FP-AMS1117-IPC_A]

### Nets
+3.3: C8.2 U2.2(VOUT) U2.4(VOUT)
+5: C9.2 R10.2 U2.3(VIN)
GND: C8.1 C9.1 D5.1(C) U2.1(Ground)
NetD5_2: D5.2(A) R10.1

### Notes on the sheet
- Power
- 3
- 5
- 2.0
- Jazoolee

### Library data of the parts
C8 C9 = CMP-2007-00033-1: as C1 on sheet MCU; Part Number: TACR226M010XTA
D5 = CMP-21615-000001-1: as D6 on sheet Main; Number of Pins: 2; Lead Free: Lead Free; Width: 1.6mm; Length: 3.2mm; REACH SVHC: No SVHC; Height: 1.1mm; Depth: 1.6mm; Power Rating: 65mW; Package Quantity: 1; Illumination Color: Red; Radiation Hardening: No; Case Code (Imperial): 1206; Max Operating Temperature: 85°C; Test Current: 20mA; Case/Package: 1206; Number of LEDs: 1; Packaging: Tape and Reel; Mount: Surface Mount; Min Operating Temperature: -40°C; Case Code (Metric): 3216; Dominant Wavelength: 626nm
R10 = CMP-2001-01475-1: Manufacturer: Yageo; Part Number: RT0805FRE072KL
U2 = CMP-209535-000001-1: LDO Voltage Regulators 1A, 3.3V; Manufacturer: Advanced Monolithic Systems; Dropout Voltage: 1.1V; Output Type: Fixed; Nominal Supply Current: 5mA; Max Power Dissipation: 1.2W; Max Supply Voltage: 15V; Number Of Outputs: 1; Standoff Height: 0.64mm; Max Junction Temp: +125°C; Height: 1.8mm; Package: AMS1117; Device Class L2: Power Management ICs; ComponentLink2Description: Datasheet; ComponentLink2URL: http://www.advanced-monolithic.com/pdf/ds1117.pdf; Category: IC; RoHS: TRUE; Automotive: No; Device Class L1: Integrated Circuits (ICs); Output Current: 1A; Device Class L3: Voltage Regulators - Linear; Temperature: -40°C to +125°C; Output Voltage: 3.3V; Manufacturer Part Number: AMS1117-3.3; Temperature Range Low: -40°C; Octopart: https://octopart.com/ams1117-3.3-advanced+monolithic+systems-25899300; Lead Free: Yes; Ipc Land Pattern Name: SOT229P700X180-4; Temperature Range High: +125°C

## Nets that join several sheets
+3.3: Main (J2.1 J3.1 J9.2 SW1.15), MCU (9 pins), Microphone (C10.1 SW9.1), Power (C8.2 U2.2 U2.4)
+5: Main (J1.1 J2.19 J3.19 SW1.16), MCU (D1.1), Amplifier Left (SW8_Amplifier_Left.1), Amplifier Right (SW8_Amplifier_Right.1), Power (C9.2 R10.2 U2.3)
GND: Main (11 pins), MCU (27 pins), Microphone (C10.2 R13.2 U3.3), Amplifier Left (IC1_Amplifier_Left.6 R12_Amplifier_Left.1), Amplifier Right (IC1_Amplifier_Right.6 R12_Amplifier_Right.1), Power (C8.1 C9.1 D5.1 U2.1)
BCLK: Main (J2.10 J3.10 SW1.13), MCU (MD1.11), Amplifier Left (IC1_Amplifier_Left.2), Amplifier Right (IC1_Amplifier_Right.2)
CLK: Main (J5.19 J6.19), MCU (MD1.20)
CMD: Main (J2.18 J3.18), MCU (MD1.19)
DIN: Main (J5.6 J6.6 SW1.9), MCU (MD1.33), Amplifier Left (IC1_Amplifier_Left.3), Amplifier Right (IC1_Amplifier_Right.3)
EN: Main (J2.2 J3.2), MCU (6 pins)
IO0: Main (J5.14 J6.14), MCU (C4.1 MD1.25 Q2.3 SW6.2)
IO2: Main (J5.15 J6.15), MCU (MD1.24)
IO4: Main (J5.13 J6.13), MCU (MD1.26)
IO5: Main (J5.10 J6.10), MCU (MD1.29)
IO12: Main (J2.13 J3.13 R14.2 SW3.2), MCU (MD1.14)
IO13: Main (J2.15 J3.15 R15.2 SW4.2), MCU (MD1.16)
IO14: Main (J2.12 J3.12), MCU (MD1.13)
IO15: Main (J5.16 J6.16), MCU (MD1.23)
IO16: Main (J5.12 J6.12), MCU (MD1.27)
IO17: Main (J5.11 J6.11), MCU (MD1.28)
IO18: Main (J5.9 J6.9), MCU (MD1.30)
IO19: Main (J5.8 J6.8), MCU (MD1.31)
IO22: Main (J5.3 J6.3 SW1.11), MCU (MD1.36), Amplifier Left (IC1_Amplifier_Left.1), Amplifier Right (IC1_Amplifier_Right.1)
IO23: Main (J5.2 J6.2), MCU (MD1.37)
IO25: Main (J2.9 J3.9 J8.2 SW1.12), MCU (MD1.10), Microphone (U3.1)
IO27: Main (J2.11 J3.11 J8.1 SW2.2), MCU (MD1.12), Microphone (U3.2)
IO32: Main (J2.7 J3.7 J9.3 SW1.10), MCU (MD1.8), Microphone (R13.1 U3.6)
IO33: Main (J2.8 J3.8 J8.3 SW1.14), MCU (MD1.9), Microphone (U3.4)
IO34: Main (J2.5 J3.5), MCU (MD1.6)
IO35: Main (J2.6 J3.6), MCU (MD1.7)
RXD0: Main (J5.5 J6.5), MCU (MD1.34 R2.1)
SD0: Main (J5.18 J6.18), MCU (MD1.21)
SD1: Main (J5.17 J6.17), MCU (MD1.22)
SD2: Main (J2.16 J3.16), MCU (MD1.17)
SD3: Main (J2.17 J3.17), MCU (MD1.18)
SENSOR VN: Main (J2.4 J3.4), MCU (MD1.5)
SENSOR VP: Main (J2.3 J3.3), MCU (MD1.4)
TXD0: Main (J5.4 J6.4), MCU (MD1.35 R1.1)